# EAGLE design LED_card_GC_REV2 (EAGLE 9.5.2)
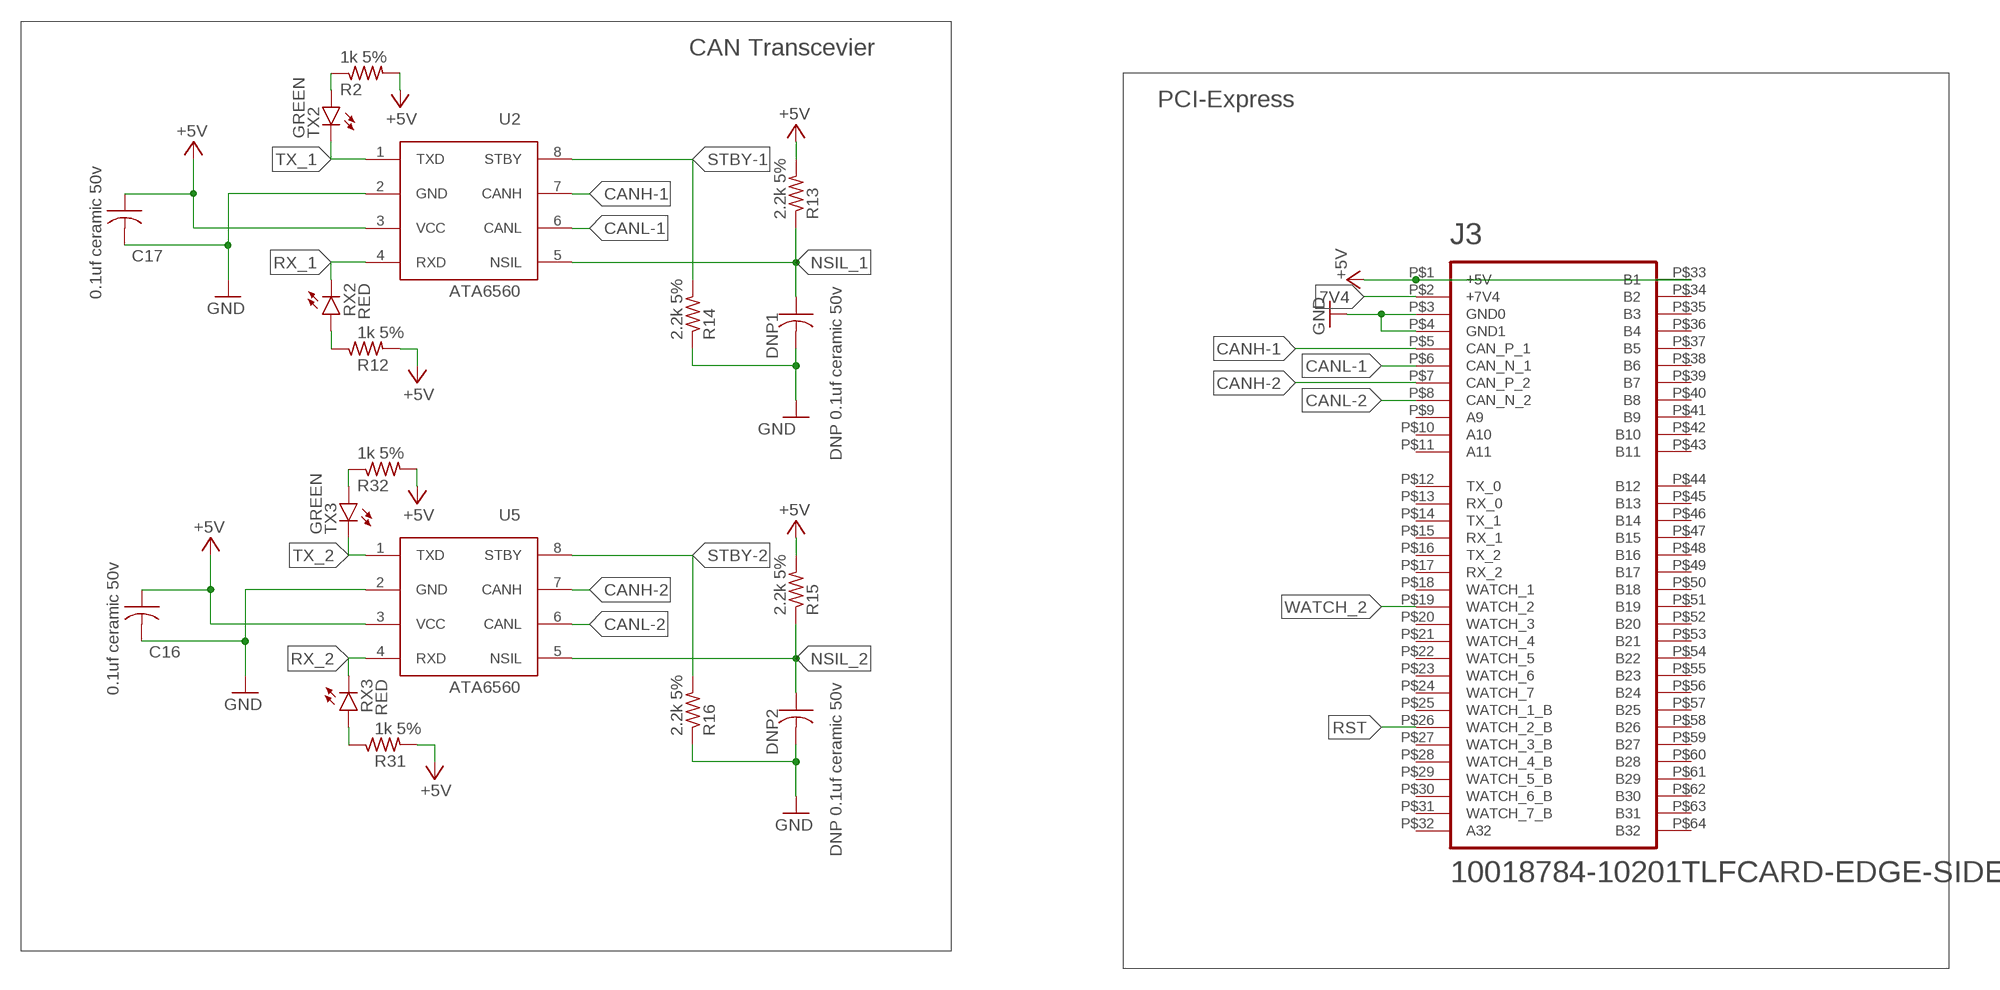
[diagram p0: schematic, sheet 1, part 1 of 3]
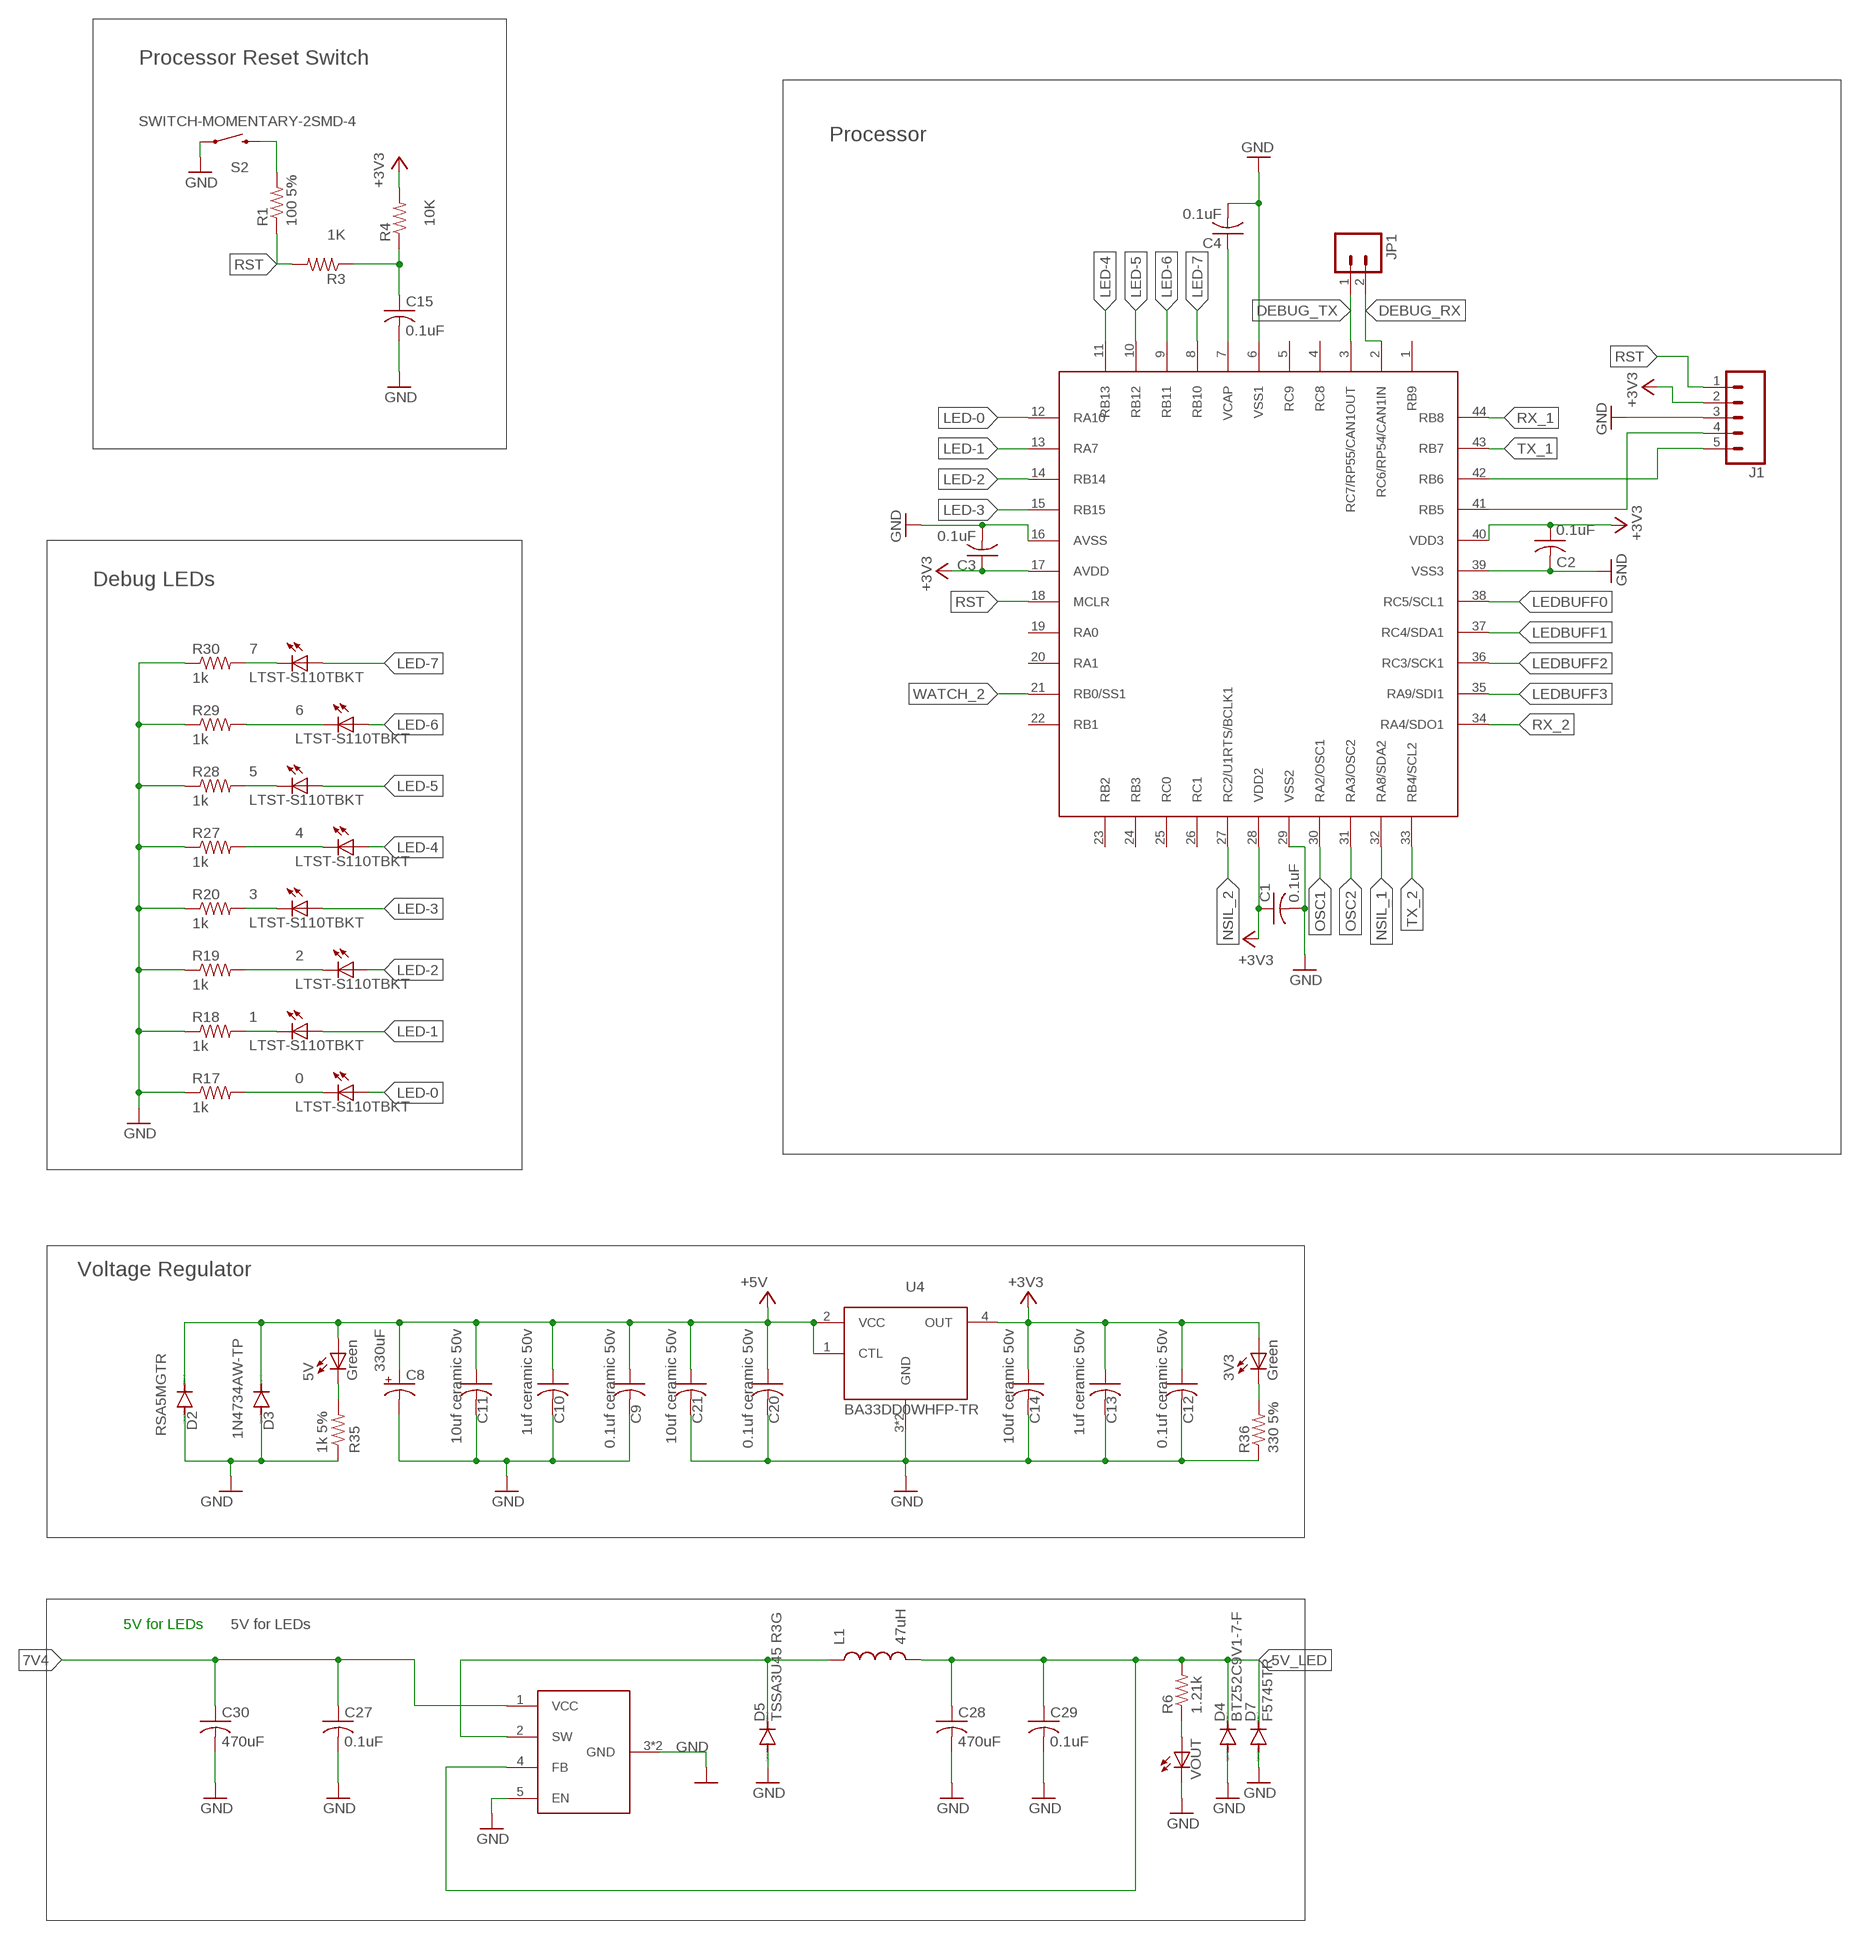
[diagram p1: schematic, sheet 1, part 2 of 3]
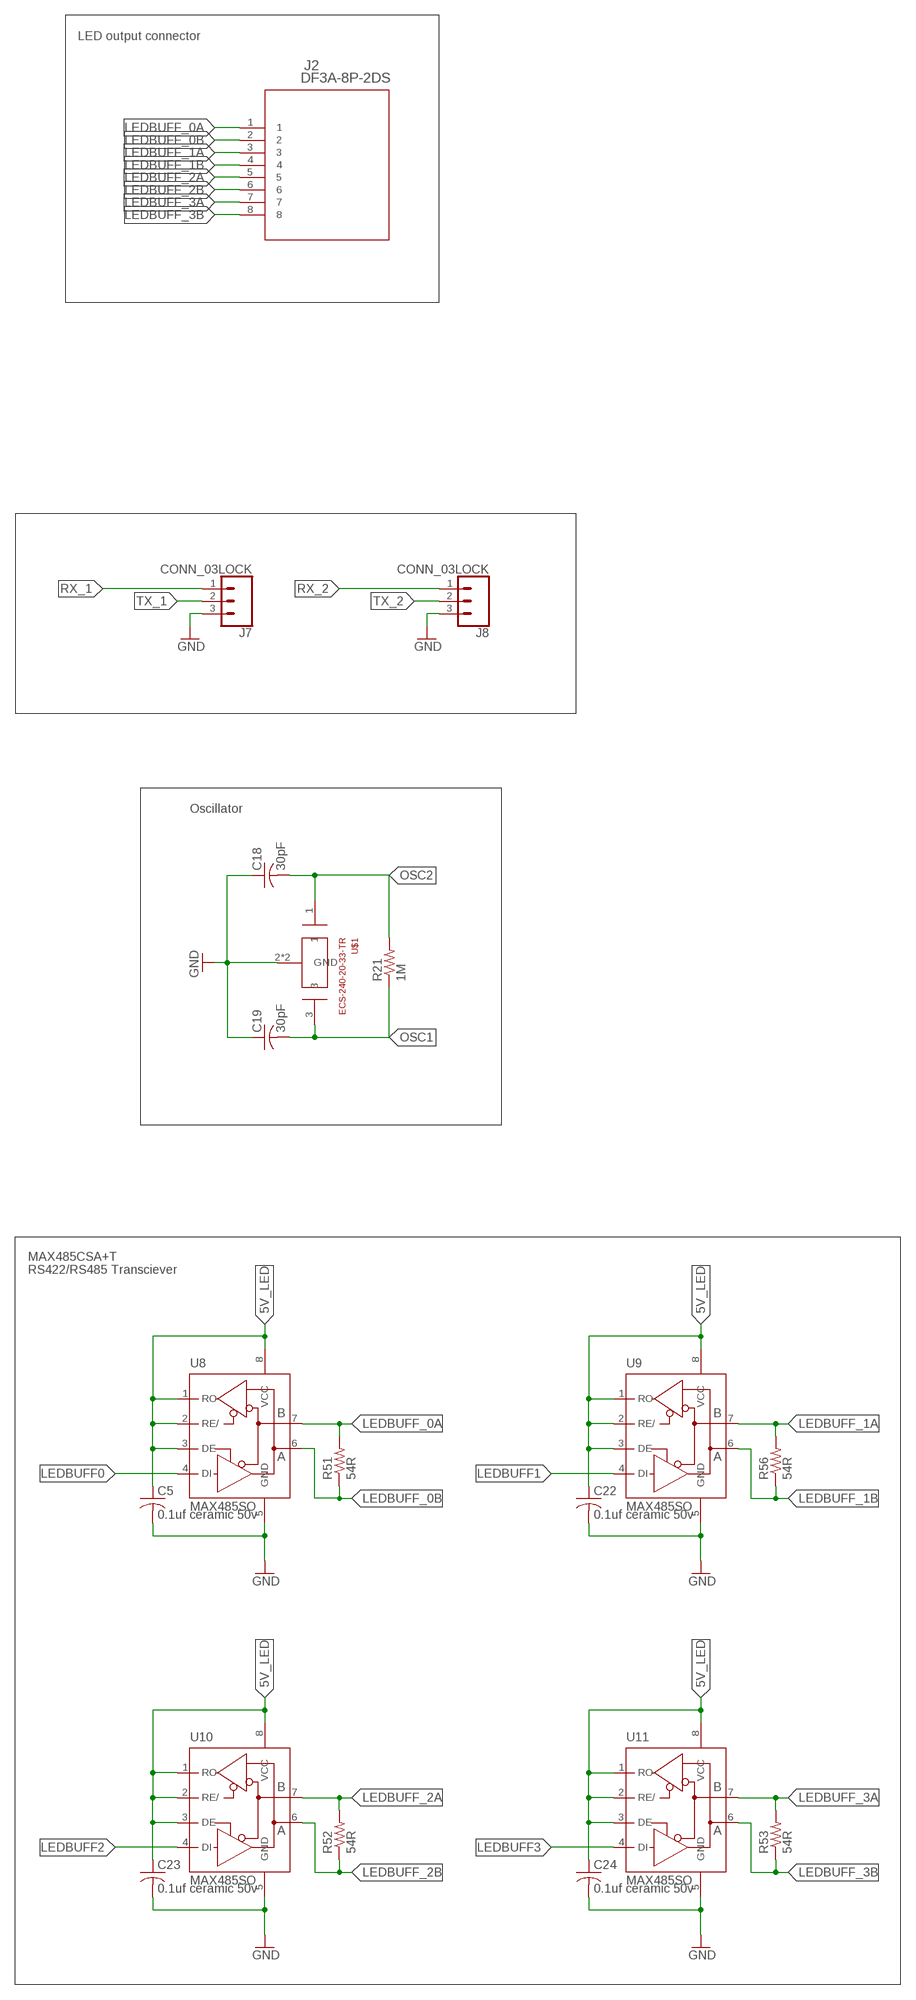
[diagram p2: schematic, sheet 1, part 3 of 3]

## Parts
0  LTST-S110TBKT  [LED-90]
1  LTST-S110TBKT  [LED-90]
2  LTST-S110TBKT  [LED-90]
3  LTST-S110TBKT  [LED-90]
3V3  Green  LTST-S110TBKT  [LED-90]
4  LTST-S110TBKT  [LED-90]
5  LTST-S110TBKT  [LED-90]
5V  Green  LTST-S110TBKT  [LED-90]
6  LTST-S110TBKT  [LED-90]
7  LTST-S110TBKT  [LED-90]
C1  0.1uF  C-US_0805C0805  [C0805]
C2  0.1uF  C-US_0805C0805  [C0805]
C3  0.1uF  C-US_0805C0805  [C0805]
C4  0.1uF  C-US_0805C0805  [C0805]
C5  0.1uf ceramic 50v  C-USC0805  [C0805]
C8  330uF  CPOL-US140CLH-1014  [140CLH-1014]
C9  0.1uf ceramic 50v  C-US_0805C0805  [C0805]
C10  1uf ceramic 50v  C-US_0805C0805  [C0805]
C11  10uf ceramic 50v  C-US_0805C0805  [C0805]
C12  0.1uf ceramic 50v  C-US_0805C0805  [C0805]
C13  1uf ceramic 50v  C-US_0805C0805  [C0805]
C14  10uf ceramic 50v  C-US_0805C0805  [C0805]
C15  0.1uF  C-US_0805C0805  [C0805]
C16  0.1uf ceramic 50v  C-US_0805C0805  [C0805]
C17  0.1uf ceramic 50v  C-US_0805C0805  [C0805]
C18  30pF  C-US_0805C0805  [C0805]
C19  30pF  C-US_0805C0805  [C0805]
C20  0.1uf ceramic 50v  C-US_0805C0805  [C0805]
C21  10uf ceramic 50v  C-US_0805C0805  [C0805]
C22  0.1uf ceramic 50v  C-USC0805  [C0805]
C23  0.1uf ceramic 50v  C-USC0805  [C0805]
C24  0.1uf ceramic 50v  C-USC0805  [C0805]
C27  0.1uF  C-USC1825  [C1825]
C28  470uF  C-USC1825  [C1825]
C29  0.1uF  C-USC1825  [C1825]
C30  470uF  C-USC1825  [C1825]
D2  RSA5MGTR  DIODE-SOD123  [SOD123]
D3  1N4734AW-TP  DIODE-SOD123  [SOD123]
D4  BTZ52C9V1-7-F  DIODE-SOD123  [SOD123]
D5  TSSA3U45 R3G  DIODE-DO214AC  [DO214AC]
D7  F5745TR  DIODE-SOD123  [SOD123]
DNP1  DNP 0.1uf ceramic 50v  C-US_0805C0805  [C0805]
DNP2  DNP 0.1uf ceramic 50v  C-US_0805C0805  [C0805]
J1  CONN_05LOCK  [1X05_LOCK]
J2  DF3A-8P-2DS  [CON8_1X8_R_DF3]
J3  10018784-10201TLFCARD-EDGE-SIDE  [CARDEDGE_SIDE]
J7  CONN_03LOCK  [1X03_LOCK]
J8  CONN_03LOCK  [1X03_LOCK]
JP1  CONN_02PTH  [1X02]
L1  47uH  INDUCTOR1  [0805]
R1  100 5%  R-US_0805R0805  [R0805]
R2  1k 5%  R-US_0805R0805  [R0805]
R3  1K  R-US_0805R0805  [R0805]
R4  10K  R-US_0805R0805  [R0805]
R6  1.21k  R-US_R0805  [R0805]
R12  1k 5%  R-US_0805R0805  [R0805]
R13  2.2k 5%  R-US_0805R0805  [R0805]
R14  2.2k 5%  R-US_0805R0805  [R0805]
R15  2.2k 5%  R-US_0805R0805  [R0805]
R16  2.2k 5%  R-US_0805R0805  [R0805]
R17  1k  R-US_0805R0805  [R0805]
R18  1k  R-US_0805R0805  [R0805]
R19  1k  R-US_0805R0805  [R0805]
R20  1k  R-US_0805R0805  [R0805]
R21  1M  R-US_0805R0805  [R0805]
R27  1k  R-US_0805R0805  [R0805]
R28  1k  R-US_0805R0805  [R0805]
R29  1k  R-US_0805R0805  [R0805]
R30  1k  R-US_0805R0805  [R0805]
R31  1k 5%  R-US_0805R0805  [R0805]
R32  1k 5%  R-US_0805R0805  [R0805]
R35  1k 5%  R-US_0805R0805  [R0805]
R36  330 5%  R-US_0805R0805  [R0805]
R51  54R  RESISTOR0805-RES  [0805]
R52  54R  RESISTOR0805-RES  [0805]
R53  54R  RESISTOR0805-RES  [0805]
R56  54R  RESISTOR0805-RES  [0805]
RX2  RED  LEDS_0805CHIP-LED0805  [CHIP-LED0805]
RX3  RED  LEDS_0805CHIP-LED0805  [CHIP-LED0805]
S2  SWITCH-MOMENTARY-2SMD-4  [TACTILE_SWITCH_TALL]
TX2  GREEN  LEDS_0805CHIP-LED0805  [CHIP-LED0805]
TX3  GREEN  LEDS_0805CHIP-LED0805  [CHIP-LED0805]
U2  ATA6560  [SO08]
U3  DSPIC33EP512GM604  [TQFP-44]
U4  BA33DD0WHFP-TR  [HRP5]
U5  ATA6560  [SO08]
U8  MAX485SO  [SO08]
U9  MAX485SO  [SO08]
U10  MAX485SO  [SO08]
U11  MAX485SO  [SO08]
U$1  ECS-240-20-33-TR  [ECX-32]
U$3  TS2596CM550  [HRP5]
VOUT1  VOUT  LEDCHIP-LED0805  [CHIP-LED0805]

## Nets
5V_LED: C5.1 C22.1 C23.1 C24.1 C28.1 C29.1 D4.C D7.C L1.2 R6.2 U8.1(RO) U8.2(RE/) U8.3(DE) U8.8(VCC) U9.1(RO) U9.2(RE/) U9.3(DE) U9.8(VCC) U10.1(RO) U10.2(RE/) U10.3(DE) U10.8(VCC) U11.1(RO) U11.2(RE/) U11.3(DE) U11.8(VCC) U$3.4(FB)
7V4: C27.1 C30.1 J3.P$2(+7V4) U$3.1(VCC)
+3V3: 3V3.+(A+) C1.1 C2.1 C3.1 C12.1 C13.1 C14.1 J1.2 R4.2 U3.17(AVDD) U3.28(VDD2) U3.40(VDD3) U4.4(OUT)
+5V: 5V.+(A+) C8.+ C9.1 C10.1 C11.1 C16.1 C17.1 C20.1 C21.1 D2.C D3.C J3.P$1(+5V) J3.P$33(B1) R2.2 R12.2 R13.2 R15.2 R31.2 R32.2 U2.3(VCC) U4.1(CTL) U4.2(VCC) U5.3(VCC)
CANH-1: J3.P$5(CAN_P_1) U2.7(CANH)
CANH-2: J3.P$7(CAN_P_2) U5.7(CANH)
CANL-1: J3.P$6(CAN_N_1) U2.6(CANL)
CANL-2: J3.P$8(CAN_N_2) U5.6(CANL)
DEBUG_RX: JP1.2 U3.2(RC6/RP54/CAN1IN)
DEBUG_TX: JP1.1 U3.3(RC7/RP55/CAN1OUT)
GND: C1.2 C2.2 C3.2 C4.2 C5.2 C8.- C9.2 C10.2 C11.2 C12.2 C13.2 C14.2 C15.2 C16.2 C17.2 C18.1 C19.1 C20.2 C21.2 C22.2 C23.2 C24.2 C27.2 C28.2 C29.2 C30.2 D2.A D3.A D4.A D5.A D7.A DNP1.2 DNP2.2 J1.3 J3.P$3(GND0) J3.P$4(GND1) J7.3 J8.3 R14.1 R16.1 R17.1 R18.1 R19.1 R20.1 R27.1 R28.1 R29.1 R30.1 R35.1 R36.1 S2.A2 U2.2(GND) U3.6(VSS1) U3.16(AVSS) U3.29(VSS2) U3.39(VSS3) U4.3(GND) U4.G(GND) U5.2(GND) U8.5(GND) U9.5(GND) U10.5(GND) U11.5(GND) U$1.2(GND) U$1.4(GND) U$3.3(GND) U$3.5(EN) U$3.G(GND) VOUT1.C
LED-0: 0.+(A+) U3.12(RA10)
LED-1: 1.+(A+) U3.13(RA7)
LED-2: 2.+(A+) U3.14(RB14)
LED-3: 3.+(A+) U3.15(RB15)
LED-4: 4.+(A+) U3.11(RB13)
LED-5: 5.+(A+) U3.10(RB12)
LED-6: 6.+(A+) U3.9(RB11)
LED-7: 7.+(A+) U3.8(RB10)
LEDBUFF0: U3.38(RC5/SCL1) U8.4(DI)
LEDBUFF1: U3.37(RC4/SDA1) U9.4(DI)
LEDBUFF2: U3.36(RC3/SCK1) U10.4(DI)
LEDBUFF3: U3.35(RA9/SDI1) U11.4(DI)
LEDBUFF_0A: J2.1 R51.2 U8.7(B)
LEDBUFF_0B: J2.2 R51.1 U8.6(A)
LEDBUFF_1A: J2.3 R56.2 U9.7(B)
LEDBUFF_1B: J2.4 R56.1 U9.6(A)
LEDBUFF_2A: J2.5 R52.2 U10.7(B)
LEDBUFF_2B: J2.6 R52.1 U10.6(A)
LEDBUFF_3A: J2.7 R53.2 U11.7(B)
LEDBUFF_3B: J2.8 R53.1 U11.6(A)
N$1 [New Class]: C15.1 R3.1 R4.1
N$2 [New Class]: R1.2 S2.B2
N$3: 5V.-(C-) R35.2
N$4: 3V3.-(C-) R36.2
N$5 [New Class]: J1.5 U3.42(RB6)
N$6: 6.-(C-) R29.2
N$7: D5.C L1.1 U$3.2(SW)
N$8: R6.1 VOUT1.A
N$35: 7.-(C-) R30.2
N$36 [New Class]: J1.4 U3.41(RB5)
N$37 [New Class]: C4.1 U3.7(VCAP)
N$39: 5.-(C-) R28.2
N$40: 4.-(C-) R27.2
N$41: 3.-(C-) R20.2
N$42: 2.-(C-) R19.2
N$43: 1.-(C-) R18.2
N$46: 0.-(C-) R17.2
N$58: R12.1 RX2.A
N$59: R2.1 TX2.A
N$60: R31.1 RX3.A
N$61: R32.1 TX3.A
NSIL_1: DNP1.1 R13.1 U2.5(NSIL) U3.32(RA8/SDA2)
NSIL_2: DNP2.1 R15.1 U3.27(RC2/U1RTS/BCLK1) U5.5(NSIL)
OSC1: C19.2 R21.1 U3.30(RA2/OSC1) U$1.3
OSC2: C18.2 R21.2 U3.31(RA3/OSC2) U$1.1
RST [New Class]: J1.1 J3.P$26(WATCH_2_B) R1.1 R3.2 U3.18(MCLR)
RX_1: J7.1 RX2.C U2.4(RXD) U3.44(RB8)
RX_2: J8.1 RX3.C U3.34(RA4/SDO1) U5.4(RXD)
STBY-1: R14.2 U2.8(STBY)
STBY-2: R16.2 U5.8(STBY)
TX_1: J7.2 TX2.C U2.1(TXD) U3.43(RB7)
TX_2: J8.2 TX3.C U3.33(RB4/SCL2) U5.1(TXD)
WATCH_2: J3.P$19(WATCH_2) U3.21(RB0/SS1)
Unconnected: J3.P$9(A9) J3.P$10(A10) J3.P$11(A11) J3.P$12(TX_0) J3.P$13(RX_0) J3.P$14(TX_1) J3.P$15(RX_1) J3.P$16(TX_2) J3.P$17(RX_2) J3.P$18(WATCH_1) J3.P$20(WATCH_3) J3.P$21(WATCH_4) J3.P$22(WATCH_5) J3.P$23(WATCH_6) J3.P$24(WATCH_7) J3.P$25(WATCH_1_B) J3.P$27(WATCH_3_B) J3.P$28(WATCH_4_B) J3.P$29(WATCH_5_B) J3.P$30(WATCH_6_B) J3.P$31(WATCH_7_B) J3.P$32(A32) J3.P$34(B2) J3.P$35(B3) J3.P$36(B4) J3.P$37(B5) J3.P$38(B6) J3.P$39(B7) J3.P$40(B8) J3.P$41(B9) J3.P$42(B10) J3.P$43(B11) J3.P$44(B12) J3.P$45(B13) J3.P$46(B14) J3.P$47(B15) J3.P$48(B16) J3.P$49(B17) J3.P$50(B18) J3.P$51(B19) J3.P$52(B20) J3.P$53(B21) J3.P$54(B22) J3.P$55(B23) J3.P$56(B24) J3.P$57(B25) J3.P$58(B26) J3.P$59(B27) J3.P$60(B28) J3.P$61(B29) J3.P$62(B30) J3.P$63(B31) J3.P$64(B32) U3.1(RB9) U3.4(RC8) U3.5(RC9) U3.19(RA0) U3.20(RA1) U3.22(RB1) U3.23(RB2) U3.24(RB3) U3.25(RC0) U3.26(RC1)

## Notes on the sheet
- CAN Transcevier
- PCI-Express
- LED output connector
- Processor Reset Switch
- Processor
- Oscillator
- Debug LEDs
- MAX485CSA+T
  RS422/RS485 Transciever
- Voltage Regulator
- 5V for LEDs | 5V for LEDs

## Library data of the parts
0 1-3 3V3 4 5 5V 6 7 = UA_NASA_RMC-Diodes:LTST-S110TBKT
C1-C4 C9-C21 DNP1 DNP2 = UA_NASA_RMC-Capacitors:C-US_0805: CAPACITOR, American symbol; SPICEPREFIX: C
C5 C22-C24 = rcl:C-US: CAPACITOR, American symbol
C8 = UA_NASA_RMC-Capacitors:CPOL-US: POLARIZED CAPACITOR, American symbol
C27-C30 = adafruit:C-US: CAPACITOR, American symbol
D2 D4 D5 D7 = UA_NASA_RMC-Diodes:DIODE-: DIODE
D3 = UA_NASA_RMC-Diodes:DIODE-: DIODE; SPICEPREFIX: D
J1 = UA_NASA_RMC-Connectors:CONN_05: Multi connection point. Often used as Generic Header-pin footprint for 0.1 inch spaced/style header connections On any of the 0.1 inch spaced packages, you can populate with these: Break Away Headers - Straight <https://www.sparkfun.com/products/116> (PRT-00116) Break Away Male Headers - Right Angle <https://www.sparkfun.com/products/553> (PRT-00553) Female Headers <https://www.sparkfun.com/products/115> (PRT-00115) Break Away Headers - Machine Pin <https://www.sparkfun.com/products/117> (PRT-00117) Break Away Female Headers - Swiss Machine Pin <https://www.sparkfun.com/products/743> (PRT-00743) For SCREWTERMINALS and SPRING TERMINALS visit here: Screw Terimnals on SparkFun.com <https://www.sparkfun.com/search/results?term=Screw+Terminals> (5mm/3.5mm/2.54mm spacing) This device is also useful as a general connection point to wire up your design to another part of your project. Our various solder wires solder well into these plated through hole pads. Hook-Up Wire - Assortment (Stranded, 22 AWG) <https://www.sparkfun.com/products/11375> (PRT-11375) Hook-Up Wire - Assortment (Solid Core, 22 AWG) <https://www.sparkfun.com/products/11367> (PRT-11367) View the entire wire category on our website here <https://www.sparkfun.com/categories/141> Special notes: Molex polarized connector foot print use with SKU : PRT-08231 with associated crimp pins and housings. 1MM SMD Version SKU: PRT-10208
J2 = UA_NASA_RMC-Connectors:DF3A-8P-2DS; BUILT_BY: EMA_UL_Team; MANUFACTURER_PART_NUMBER: DF3A-8P-2DS; VENDOR: Hirose
J3 = Through_hole_card_edge_v1:10018784-10201TLF: CONN PCI EXP FEMALE 64POS 0.039
J7 J8 = UA_NASA_RMC-Connectors:CONN_03: Multi connection point. Often used as Generic Header-pin footprint for 0.1 inch spaced/style header connections On any of the 0.1 inch spaced packages, you can populate with these: Break Away Headers - Straight <https://www.sparkfun.com/products/116> (PRT-00116) Break Away Male Headers - Right Angle <https://www.sparkfun.com/products/553> (PRT-00553) Female Headers <https://www.sparkfun.com/products/115> (PRT-00115) Break Away Headers - Machine Pin <https://www.sparkfun.com/products/117> (PRT-00117) Break Away Female Headers - Swiss Machine Pin <https://www.sparkfun.com/products/743> (PRT-00743) Stackable Header - 3 Pin (Female, 0.1") <https://www.sparkfun.com/products/13875> (PRT-13875) For SCREWTERMINALS and SPRING TERMINALS visit here: Screw Terimnals on SparkFun.com <https://www.sparkfun.com/search/results?term=Screw+Terminals> (5mm/3.5mm/2.54mm spacing) This device is also useful as a general connection point to wire up your design to another part of your project. Our various solder wires solder well into these plated through hole pads. Hook-Up Wire - Assortment (Stranded, 22 AWG) <https://www.sparkfun.com/products/11375> (PRT-11375) Hook-Up Wire - Assortment (Solid Core, 22 AWG) <https://www.sparkfun.com/products/11367> (PRT-11367) View the entire wire category on our website here <https://www.sparkfun.com/categories/141> Special notes: Molex polarized connector foot print use with SKU : PRT-08232 with associated crimp pins and housings.
JP1 = UA_NASA_RMC-Connectors:CONN_02: Standard 2-pin 0.1" header. Use with - straight break away headers ( PRT-00116) - right angle break away headers (PRT-00553) - swiss pins (PRT-00743) - machine pins (PRT-00117) - female headers (PRT-00115) Molex polarized connector foot print use with: PRT-08233 with associated crimp pins and housings. 2.54_SCREWTERM for use with PRT-10571. 3.5mm Screw Terminal footprints for PRT-08084 5mm Screw Terminal footprints for use with PRT-08432
L1 = UA_NASA_RMC-Inductors:INDUCTOR: Inductor 27uf Octopart <https://octopart.com/search?q=ISL83077EIBZA> https://octopart.com/search?q=AIML-0805-270K-T -NASA ROBOTICS
R1-R4 R12-R21 R27-R32 R35 R36 = UA_NASA_RMC-Resistors:R-US_0805: RESISTOR, American symbol; SPICEPREFIX: R
R6 = adafruit:R-US_: RESISTOR, American symbol
R51-R53 R56 = SparkFun-Resistors:RESISTOR: Resistor Basic schematic elements and footprints for 0603, 1206, and PTH resistors.
RX2 RX3 TX2 TX3 = UA_NASA_RMC-Diodes:LEDS_0805: LED 0805 OSRAM: - CHIPLED LG R971, LG N971, LY N971, LG Q971, LY Q971, LO R971, LY R971 LH N974, LH R974 LS Q976, LO Q976, LY Q976 LO Q996 - Hyper CHIPLED LW Q18S LB Q993, LB Q99A, LB R99A - SideLED LS A670, LO A670, LY A670, LG A670, LP A670 LB A673, LV A673, LT A673, LW A673 LH A674 LY A675 LS A676, LA A676, LO A676, LY A676, LW A676 LS A679, LY A679, LG A679 - Hyper Micro SIDELED® LS Y876, LA Y876, LO Y876, LY Y876 LT Y87S - SmartLED LW L88C, LW L88S LB L89C, LB L89S, LG L890 LS L89K, LO L89K, LY L89K LS L896, LA L896, LO L896, LY L896 - TOPLED LS T670, LO T670, LY T670, LG T670, LP T670 LSG T670, LSP T670, LSY T670, LOP T670, LYG T670 LG T671, LOG T671, LSG T671 LB T673, LV T673, LT T673, LW T673 LH T674 LS T676, LA T676, LO T676, LY T676, LB T676, LH T676, LSB T676, LW T676 LB T67C, LV T67C, LT T67C, LS T67K, LO T67K, LY T67K, LW E67C LS E67B, LA E67B, LO E67B, LY E67B, LB E67C, LV E67C, LT E67C LW T67C LS T679, LY T679, LG T679 LS T770, LO T770, LY T770, LG T770, LP T770 LB T773, LV T773, LT T773, LW T773 LH T774 LS E675, LA E675, LY E675, LS T675 LS T776, LA T776, LO T776, LY T776, LB T776 LHGB T686 LT T68C, LB T68C - Hyper Mini TOPLED® LB M676 - Mini TOPLED Santana® LG M470 LS M47K, LO M47K, LY M47K Source: http://www.osram.convergy.de LUXEON: - LUMILED® LXK2-PW12-R00, LXK2-PW12-S00, LXK2-PW14-U00, LXK2-PW14-V00 LXK2-PM12-R00, LXK2-PM12-S00, LXK2-PM14-U00 LXK2-PE12-Q00, LXK2-PE12-R00, LXK2-PE12-S00, LXK2-PE14-T00, LXK2-PE14-U00 LXK2-PB12-K00, LXK2-PB12-L00, LXK2-PB12-M00, LXK2-PB14-N00, LXK2-PB14-P00, LXK2-PB14-Q00 LXK2-PR12-L00, LXK2-PR12-M00, LXK2-PR14-Q00, LXK2-PR14-R00 LXK2-PD12-Q00, LXK2-PD12-R00, LXK2-PD12-S00 LXK2-PH12-R00, LXK2-PH12-S00 LXK2-PL12-P00, LXK2-PL12-Q00, LXK2-PL12-R00 Source: www.luxeon.com KINGBRIGHT: KA-3528ASYC Source: www.kingbright.com
S2 = UA_NASA_RMC-Switches:SWITCH-MOMENTARY-2: Various NO switches- pushbuttons, reed, etc Series: PTS645; PROD_ID: SWCH-11966
U2 U5 = UA_NASA_RMC-Microcontrollers:ATA6560
U3 = UA_NASA_RMC-Microcontrollers:DSPIC33EP512GM604
U4 = UA_NASA_RMC-Microcontrollers:BA33DD0WHFP-TR
U8-U11 = NASA_LIB (1):MAX485
U$1 = UA_NASA_RMC-Oscillators:ECS-240-20-33-TR
U$3 = UA_NASA_RMC-Microcontrollers:TS2596CM550
VOUT1 = adafruit:LED: LED OSRAM: - CHIPLED LG R971, LG N971, LY N971, LG Q971, LY Q971, LO R971, LY R971 LH N974, LH R974 LS Q976, LO Q976, LY Q976 LO Q996 - Hyper CHIPLED LW Q18S LB Q993, LB Q99A, LB R99A - SideLED LS A670, LO A670, LY A670, LG A670, LP A670 LB A673, LV A673, LT A673, LW A673 LH A674 LY A675 LS A676, LA A676, LO A676, LY A676, LW A676 LS A679, LY A679, LG A679 - Hyper Micro SIDELED® LS Y876, LA Y876, LO Y876, LY Y876 LT Y87S - SmartLED LW L88C, LW L88S LB L89C, LB L89S, LG L890 LS L89K, LO L89K, LY L89K LS L896, LA L896, LO L896, LY L896 - TOPLED LS T670, LO T670, LY T670, LG T670, LP T670 LSG T670, LSP T670, LSY T670, LOP T670, LYG T670 LG T671, LOG T671, LSG T671 LB T673, LV T673, LT T673, LW T673 LH T674 LS T676, LA T676, LO T676, LY T676, LB T676, LH T676, LSB T676, LW T676 LB T67C, LV T67C, LT T67C, LS T67K, LO T67K, LY T67K, LW E67C LS E67B, LA E67B, LO E67B, LY E67B, LB E67C, LV E67C, LT E67C LW T67C LS T679, LY T679, LG T679 LS T770, LO T770, LY T770, LG T770, LP T770 LB T773, LV T773, LT T773, LW T773 LH T774 LS E675, LA E675, LY E675, LS T675 LS T776, LA T776, LO T776, LY T776, LB T776 LHGB T686 LT T68C, LB T68C - Hyper Mini TOPLED® LB M676 - Mini TOPLED Santana® LG M470 LS M47K, LO M47K, LY M47K Source: http://www.osram.convergy.de/

## Board
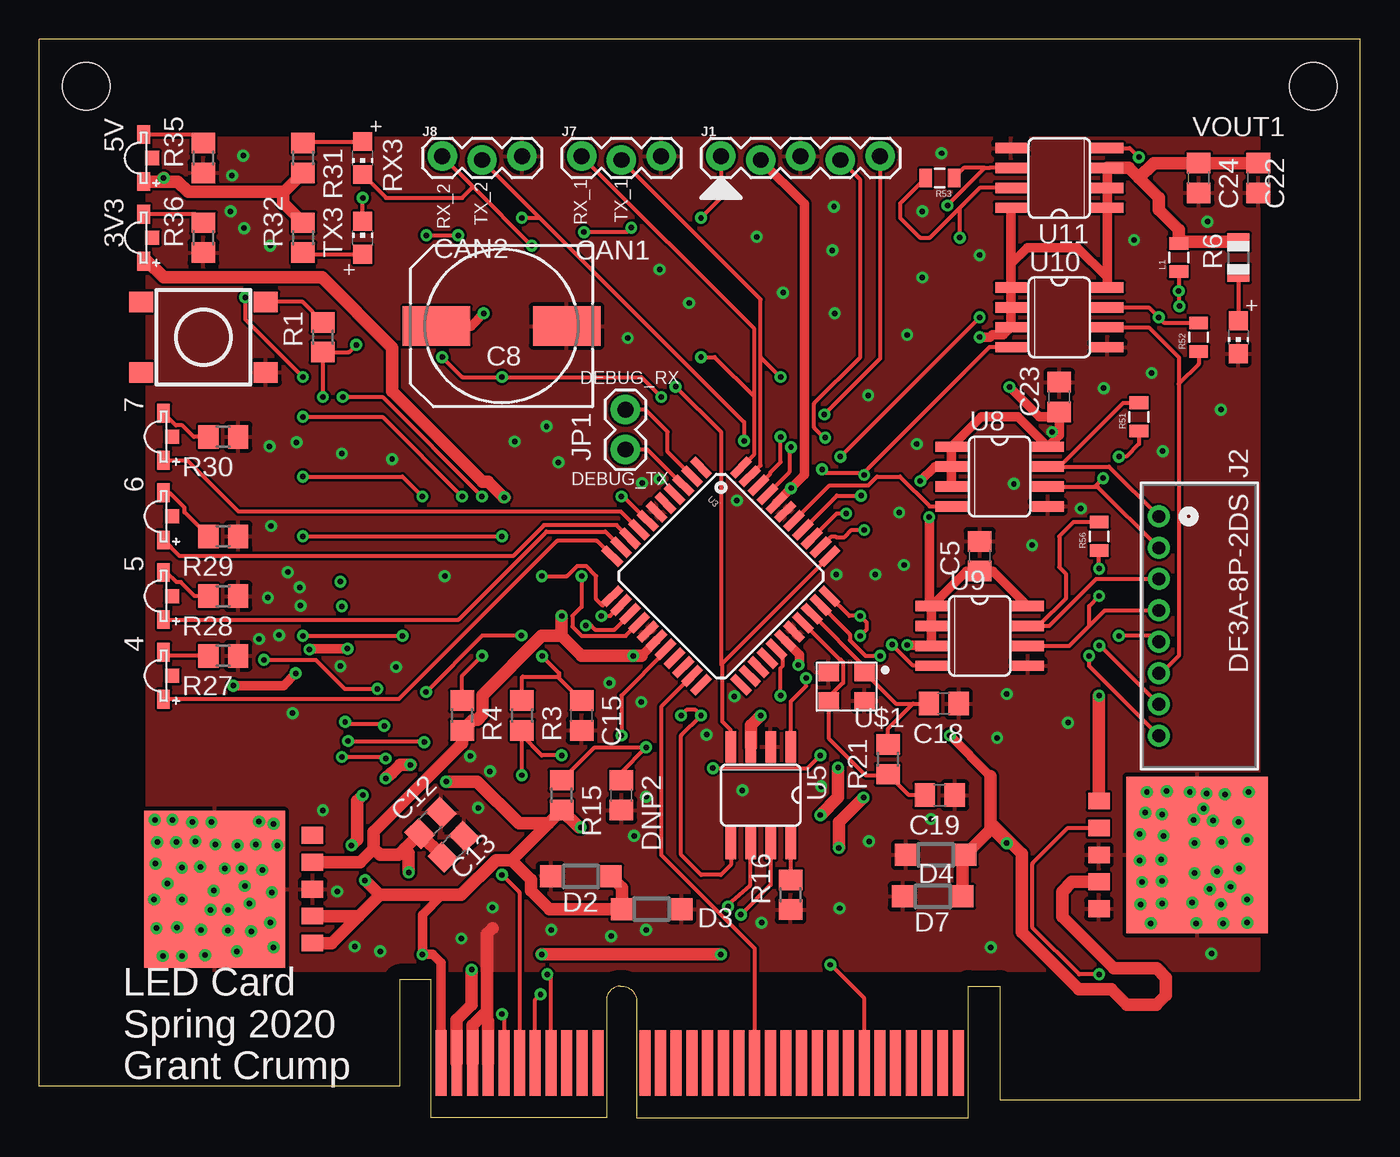
[diagram p3: board, top side]
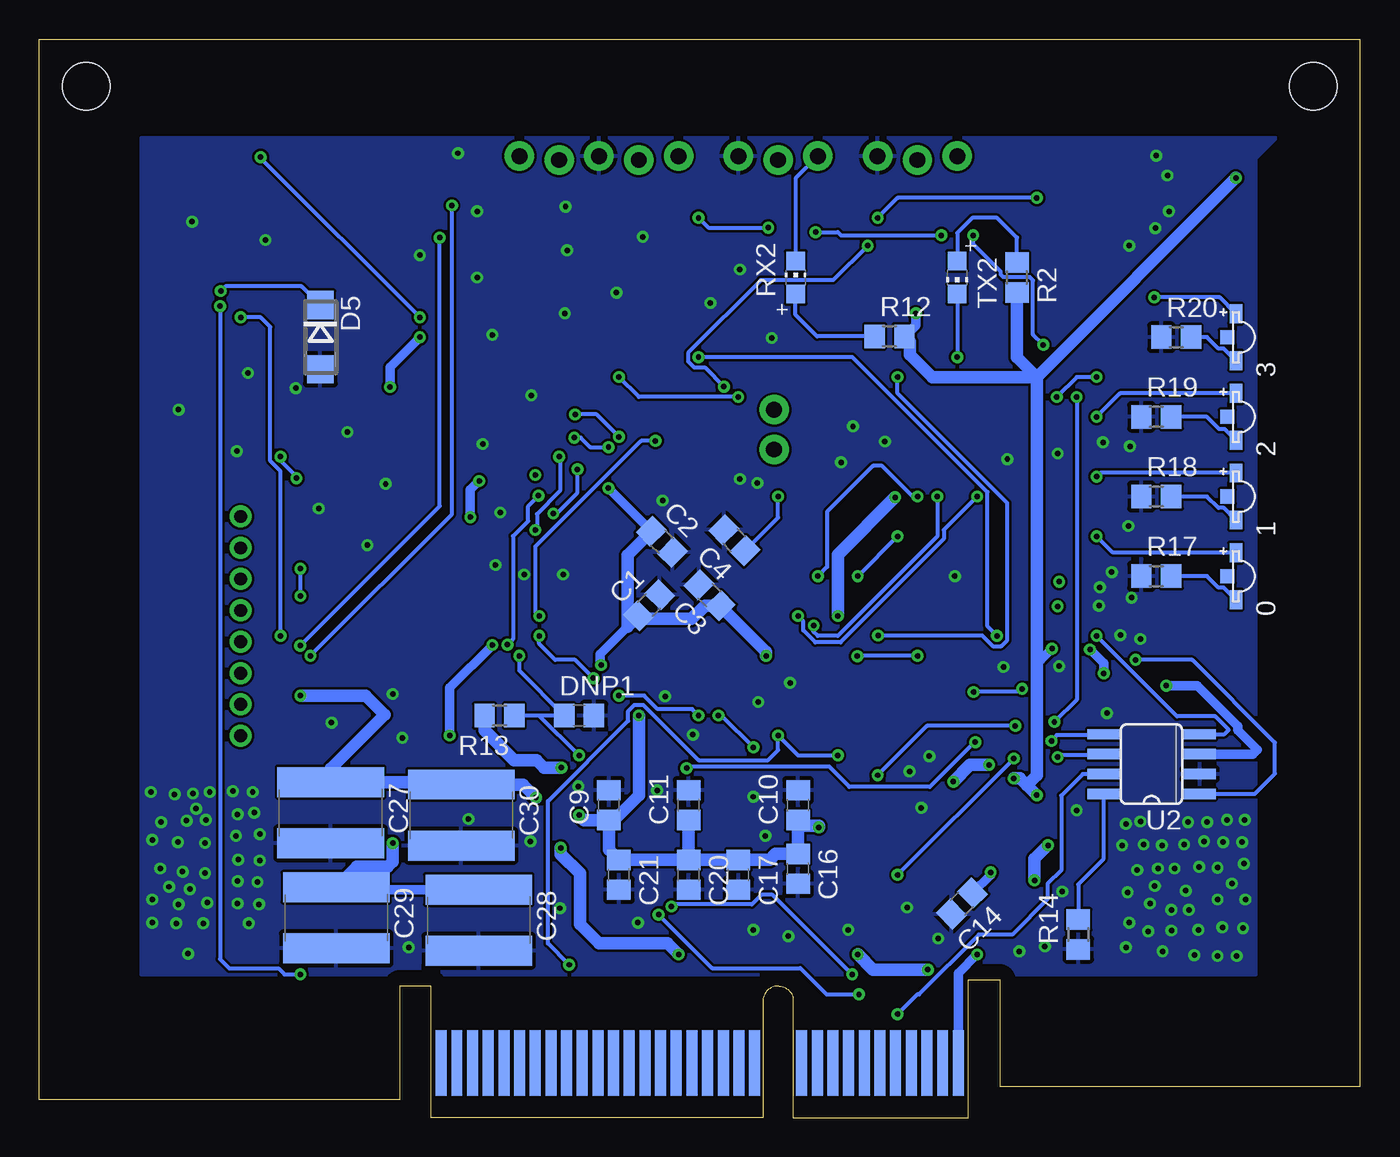
[diagram p4: board, bottom side, seen from below]

Size 84.3 x 68.8 mm. Coordinates in mm from the lower left corner, seen from the top.
Copper layers (1*16): Top 0.035mm / dielectric 1.5mm / Bottom 0.035mm
Design rules "default": minimum track width 6mil, minimum drill 0.35mm, track to track 6mil, track to pad 6mil, pad to pad 6mil, via to via 6mil, smd to smd 6mil, copper to edge 40mil, drill to drill 6mil, minimum pad ring 10mil, minimum via ring 8mil, stop-mask expansion 4mil, vias tented up to drill 0mil, thermal gap 10mil

### Footprints (pad centres in the part's own frame; a part is rotated, then mirrored left to right if it is on the bottom)
LED-90 = smd 0.8 x 1.2: + 0,1.5; - 0,-1.5 | smd 0.9 x 0.9: NC -0.55,0
C0805 = smd 1.3 x 1.5: 1 -0.95,0; 2 0.95,0
140CLH-1014 = smd 4.3 x 2.5: + 4.15,0; - -4.15,0
C1825 = smd 1.9 x 6.8: 1 -1.95,0; 2 1.95,0
SOD123 = smd 1.4 x 1.4: A 1.9,0; C -1.9,0
DO214AC = smd 1.8 x 1.7: A 2.05,0; C -2.05,0
1X05_LOCK = drill 1.016 pad 1.88: 1 0,0.127; 2 2.54,-0.127; 3 5.08,0.127; 4 7.62,-0.127; 5 10.16,0.127
CON8_1X8_R_DF3 = drill 0.813 pad 1.397: 1 0,0; 2 -2.007,0; 3 -3.988,0; 4 -5.994,0; 5 -8.001,0; 6 -10.008,0; 7 -11.989,0; 8 -13.995,0
CARDEDGE_SIDE = smd 0.7 x 4.2: P$1 -11.5,0.7; P$2 -10.5,0.7; P$3 -9.5,0.7; P$4 -8.5,0.7; P$5 -7.5,0.7; P$6 -6.5,0.7; P$7 -5.5,0.7; P$8 -4.5,0.7; P$9 -3.5,0.7; P$10 -2.5,0.7; P$11 -1.5,0.7; P$12 1.5,0.7; P$13 2.5,0.7; P$14 3.5,0.7; P$15 4.5,0.7; P$16 5.5,0.7; P$17 6.5,0.7; P$18 7.5,0.7; P$19 8.5,0.7; P$20 9.5,0.7; P$21 10.5,0.7; P$22 11.5,0.7; P$23 12.5,0.7; P$24 13.5,0.7; P$25 14.5,0.7; P$26 15.5,0.7; P$27 16.5,0.7; P$28 17.5,0.7; P$29 18.5,0.7; P$30 19.5,0.7; P$31 20.5,0.7; P$32 21.5,0.7 | smd 0.7 x 4.2 bottom: P$33 -11.5,0.7; P$34 -10.5,0.7; P$35 -9.5,0.7; P$36 -8.5,0.7; P$37 -7.5,0.7; P$38 -6.5,0.7; P$39 -5.5,0.7; P$40 -4.5,0.7; P$41 -3.5,0.7; P$42 -2.5,0.7; P$43 -1.5,0.7; P$44 1.5,0.7; P$45 2.5,0.7; P$46 3.5,0.7; P$47 4.5,0.7; P$48 5.5,0.7; P$49 6.5,0.7; P$50 7.5,0.7; P$51 8.5,0.7; P$52 9.5,0.7; P$53 10.5,0.7; P$54 11.5,0.7; P$55 12.5,0.7; P$56 13.5,0.7; P$57 14.5,0.7; P$58 15.5,0.7; P$59 16.5,0.7; P$60 17.5,0.7; P$61 18.5,0.7; P$62 19.5,0.7; P$63 20.5,0.7; P$64 21.5,0.7 | hole 3: -34.15,63; 44.15,63
1X03_LOCK = drill 1.016 pad 1.88: 1 0,0.127; 2 2.54,-0.127; 3 5.08,0.127
1X02 = drill 1.016 pad 1.88: 1 0,0; 2 2.54,0
0805 = smd 0.8 x 1.2: 1 -0.9,0; 2 0.9,0
R0805 = smd 1.3 x 1.5: 1 -0.95,0; 2 0.95,0
R0805' = smd 1.1 x 1.4: 1 -1,0; 2 1,0
CHIP-LED0805 = smd 1.2 x 1.2: A 0,-1.05; C 0,1.05
TACTILE_SWITCH_TALL = smd 1.55 x 1.3: A1 -3.975,-2.25; A2 3.975,-2.25; B1 -3.975,2.25; B2 3.975,2.25
SO08 = smd 0.66 x 2.032: 1 -1.905,-3.073; 2 -0.635,-3.073; 3 0.635,-3.073; 4 1.905,-3.073; 5 1.905,3.073; 6 0.635,3.073; 7 -0.635,3.073; 8 -1.905,3.073
TQFP-44 = smd 1.5 x 0.5: 1 -5.8,4; 2 -5.8,3.2; 3 -5.8,2.4; 4 -5.8,1.6; 5 -5.8,0.8; 6 -5.8,0; 7 -5.8,-0.8; 8 -5.8,-1.6; 9 -5.8,-2.4; 10 -5.8,-3.2; 11 -5.8,-4; 23 5.8,-4; 24 5.8,-3.2; 25 5.8,-2.4; 26 5.8,-1.6; 27 5.8,-0.8; 28 5.8,0; 29 5.8,0.8; 30 5.8,1.6; 31 5.8,2.4; 32 5.8,3.2; 33 5.8,4 | smd 0.5 x 1.5: 12 -4,-5.8; 13 -3.2,-5.8; 14 -2.4,-5.8; 15 -1.6,-5.8; 16 -0.8,-5.8; 17 0,-5.8; 18 0.8,-5.8; 19 1.6,-5.8; 20 2.4,-5.8; 21 3.2,-5.8; 22 4,-5.8; 34 4,5.8; 35 3.2,5.8; 36 2.4,5.8; 37 1.6,5.8; 38 0.8,5.8; 39 0,5.8; 40 -0.8,5.8; 41 -1.6,5.8; 42 -2.4,5.8; 43 -3.2,5.8; 44 -4,5.8
HRP5 = smd 1.07 x 1.37: 1 -3.44,0; 2 -1.72,0; 3 0,0; 4 1.72,0; 5 3.44,0 | smd 10 x 9: G 0,6.254
ECX-32 = smd 1.3 x 1.1: 1 -1.15,-0.9; 2 1.15,-0.9; 3 1.15,0.9; 4 -1.15,0.9

### Placement (x,y rotation side)
0  7.94,34.55 0 bottom
1  7.94,39.63 0 bottom
2  7.94,44.71 0 bottom
3  7.94,49.79 0 bottom
3V3  6.67,56.14 180 top
4  7.94,28.2 180 top
5  7.94,33.28 180 top
5V  6.67,61.22 180 top
6  7.94,38.36 180 top
7  7.94,43.44 180 top
C1  45.38,32.7 45 bottom
C2  44.57,36.73 315 bottom
C3  41.52,33.33 135 bottom
C4  39.94,36.84 135 bottom
C5  60.01,35.82 90 top
C8  29.5,50.5 180 top
C9  47.95,19.95 90 bottom
C10  35.88,19.95 90 bottom
C11  42.86,19.95 90 bottom
C12  24.96,18.8 45 top
C13  26.43,17.28 45 top
C14  25.42,13.67 225 bottom
C15  34.61,25.66 270 top
C16  35.88,15.88 270 bottom
C17  39.69,15.5 270 bottom
C18  57.72,26.42 180 top
C19  57.47,20.58 180 top
C20  42.86,15.5 270 bottom
C21  47.31,15.5 270 bottom
C22  77.79,59.95 270 top
C23  65.09,45.98 90 top
C24  73.98,59.95 270 top
C27  65.7,19.46 270 bottom
C28  56.25,12.6 270 bottom
C29  65.34,12.76 270 bottom
C30  57.37,19.31 270 bottom
D2  34.56,15.4 180 top
D3  39.08,13.32 0 top
D4  57.22,16.77 180 top
D5  66.36,49.79 270 bottom
D7  57.01,14.13 180 top
DNP1  49.85,25.66 0 bottom
DNP2  37.15,20.58 270 top
J1  43.5,61.22 0 top
J2  71.44,38.36 90 top
J3  37.15,2.8 0 top
J7  34.61,61.22 0 top
J8  25.72,61.22 0 top
JP1  37.4,42.63 90 top
L1  72.71,54.87 90 top
R1  18.1,49.79 90 top
R2  21.91,53.6 270 bottom
R3  30.8,25.66 270 top
R4  26.99,25.66 270 top
R6  1.21k  [R0805']  76.52,54.87 90 top
R12  30.04,49.84 0 bottom
R13  54.93,25.66 180 bottom
R14  18,11.69 90 bottom
R15  33.34,20.58 270 top
R16  47.95,14.23 90 top
R17  13.02,34.55 0 bottom
R18  13.02,39.63 0 bottom
R19  13.02,44.71 0 bottom
R20  11.75,49.79 0 bottom
R21  54.17,22.87 90 top
R27  11.75,29.47 180 top
R28  11.75,33.28 180 top
R29  11.75,37.09 180 top
R30  11.75,43.44 180 top
R31  16.83,61.22 270 top
R32  16.83,56.14 90 top
R35  10.48,61.22 90 top
R36  10.48,56.14 90 top
R51  70.17,44.71 90 top
R52  73.98,49.79 90 top
R53  57.47,59.95 180 top
R56  67.63,37.09 90 top
RX2  36.03,53.6 0 bottom
RX3  20.64,61.22 180 top
S2  10.48,49.79 0 top
TX2  25.72,53.6 180 bottom
TX3  20.64,56.14 0 top
U2  13.32,22.56 90 bottom
U3  43.5,34.55 315 top
U4  17.44,14.59 90 top
U5  46.04,20.58 180 top
U8  61.28,40.9 270 top
U9  60.01,30.74 270 top
U10  65.09,51.06 270 top
U11  65.09,59.95 90 top
U$1  51.52,27.51 180 top
U$3  67.63,16.77 270 top
VOUT1  76.52,49.79 180 top

### Tracks (layer width: path | path; a pad name or v marks a point on that pad's centre or on a via)
5V_LED  (via drill 0.35)
  Top 0.61: U8.2 U8.1 60.11,44.71 62.45,44.71 U8.8 65.09,43.54 65.09,44.71 | U8.2 U8.3 | 65.09,44.71 C23.1 | U10.8 68.16,53.6 | 68.16,53.6 U11.1 U11.2 U11.3 | U9.1 56.79,32.79 v56.79,38.31 | v56.22,40.62 57.14,41.53 U8.2 | U9.1 59.16,34.87 C5.1 60.86,34.87 U9.8 | v55.38,30.16 56.89,30.16 U9.3 U9.2 U9.1 | 60.71,21.79 v58.1,24.39 | v60.01,49.79 60.66,49.79 60.81,49.94 61.53,49.94 U10.3 U10.2 U10.1 62.02,54.46 | v61.91,46.61 63.82,44.71 65.09,44.71 | 68.16,53.6 66.26,55.5 63.06,55.5 62.02,54.46 | 62.02,54.46 U11.8
  Top 0.813: 70.17,59.95 71.44,58.68 71.44,57.92 72.71,56.65 L1.2 72.81,55.87 R6.2 | 70.17,59.95 69.53,60.58 U11.3 | C22.1 C24.1 71.12,60.9 70.17,59.95 | D7.C 58.91,16.57 D4.C 60.71,18.36 | 60.71,18.36 60.71,18.85 | 60.71,18.85 60.71,21.79 | v61.74,17.52 60.89,18.36 60.71,18.36 | 60.71,18.85 62.7,16.86 62.7,11.84 66.33,8.21 67.5,8.21 68.42,8.21 69.41,7.22 71.29,7.22 71.9,7.83 71.9,8.95 71.31,9.54 68.57,9.54 65.29,12.81 65.29,14.43 65.91,15.05 U$3.4
  Bottom 0.61: v56.79,38.31 56.79,40.06 v56.22,40.62 | v55.38,30.16 58.1,27.44 v58.1,24.39 | C29.1 65.19,14.55 C28.1 | v60.01,49.79 61.91,47.88 v61.91,46.61
  Bottom 0.813: C29.1 64.05,16 62.07,16 61.74,16.33 v61.74,17.52
7V4  (via drill 0.35)
  Top 0.813: v43.5,10.42 v32.07,10.42 | v27.6,9.46 27.6,7.22 26.65,6.27 J3.P$2 | v67.63,26.93 U$3.1 | v52.6,20.43 51.02,18.84 v51.02,17.22
  Bottom 0.813: v43.5,10.42 44.21,11.13 48.58,11.13 49.8,12.35 49.8,15.6 51.02,16.82 v51.02,17.22 | v32.07,10.42 31.1,9.46 v27.6,9.46 | v67.63,26.93 63.48,26.93 62.27,25.71 65.7,22.28 C27.1 57.52,21.41 C30.1 56.81,21.26 53.44,21.26 v52.6,20.43
+3V3  (via drill 0.35)
  Top 0.152: 3V3.+ 6.9,54.64
  Top 0.61: J1.2 48.83,58.3 48.83,41.02 v47.98,40.16 U3.40 | U3.28 48.51,29.54 48.51,28.94 v48.45,28.88 | U3.17 | U3.17 38.42,29.47
  Top 0.813: 33.34,30.74 34.61,29.47 v37.91,29.47 38.42,29.47 | 33.34,30.74 v33.34,32.01 | 6.9,54.64 7.94,53.6 18.05,53.6 22.52,49.13 22.52,46.34 28.29,40.57 28.65,40.57 29.64,39.58 v29.68,39.58 | 33.34,30.74 32.07,30.74 28.3,26.97 28.3,25.73 27.97,25.4 27.68,25.4 R4.2 26.99,23.9 21.35,18.26 21.35,17.16 | 23.31,17.15 22.93,16.77 21.75,16.77 21.35,17.16 | 23.31,17.15 C12.1 25.76,16.66 C13.1 | v23.59,15.65 23.59,16.87 23.31,17.15 | U4.4 20.49,16.31 21.35,17.16
  Bottom 0.61: C1.1 46.76,31.31 48.51,29.57 48.51,28.94 v48.45,28.88 | C14.1 23.59,15.5 v23.59,15.65 | C2.1 v47.98,40.16
  Bottom 0.813: v29.68,39.58 33.34,35.92 v33.34,32.01 | v37.91,29.47 37.91,29.72 C3.1 41.82,32.66 42.66,31.82 46.26,31.82 46.76,31.31 46.76,35.88 C2.1
+5V  (via drill 0.35)
  Top 0.61: 25.72,14.23 24.45,12.96 v24.45,10.42 25.11,10.42 25.65,9.88 J3.P$33 | v16.37,28.35 15.58,27.57 v12.38,27.57 | v17.25,29.87 17.3,29.93 v19.67,29.93 | v28.36,51.31 27.55,50.5 C8.+
  Top 0.813: v7.94,59.95 7.71,59.72 5V.+ 8.84,59.72 9.5,59.06 15.56,59.06 | v20.64,20.58 20.28,20.22 20.28,17.73 v19.93,17.38 | U4.1 18.67,11.15 20.39,12.87 | 20.39,12.87 21.76,14.23 | R31.2 15.62,59.06 15.56,59.06 | R32.2 15.56,58.36 15.56,59.06 | U5.3 45.41,25.03 v46.04,25.66 | 32.49,18.78 R15.2 34.45,18.52 v34.56,18.52 | 32.49,18.78 30.15,16.44 | 30.15,16.44 29.14,16.44 26.93,14.23 25.72,14.23 21.76,14.23 | v50.97,22.34 50.97,20.43 v49.85,19.31 | 32.49,18.78 30.61,18.78 27.95,21.44 v25.97,21.44 | v22.11,21.65 22.45,21.98 22.5,21.98 23.03,22.51 v23.69,22.51 | D2.C 37.18,14.68 D3.C 32.55,13.32 31.4,14.47 31.4,15.18 30.15,16.44 | v20.79,15.14 21.71,14.23 21.76,14.23 | U4.2 20.39,12.87
  Bottom 0.61: J3.P$33 25.65,9.22 v24.45,10.42 | v12.38,27.57 10.39,27.57 7.81,24.99 7.81,24.72 6.57,23.48 6.85,23.2 U2.3 | v16.37,28.35 16.37,29 v17.25,29.87 | v19.67,29.93 20.39,29.22 20.64,29.22 | R12.2 28.36,50.57 v28.36,51.31
  Bottom 0.813: v7.94,59.95 20.64,47.25 | 20.64,47.25 20.64,29.22 20.64,21.85 21.27,21.21 | v46.04,25.66 46.04,20.58 47.62,19 C9.1 | R12.2 28.74,49.49 28.74,48.68 27.31,47.25 20.64,47.25 | R2.2 21.91,48.52 20.64,47.25 | C20.1 C17.1 37.68,16.45 37.3,16.83 C16.1 C10.1 35.51,18.62 34.56,18.62 v34.56,18.52 | C20.1 C21.1 47.95,17.09 C9.1 | C20.1 C11.1 | R13.2 55.88,24.71 53.99,22.82 52.58,22.82 52.1,22.34 v50.97,22.34 | v49.85,19.31 49.53,19 C9.1 | v20.64,20.58 21.27,21.21 | 21.27,21.21 21.71,21.65 v22.11,21.65 | v23.69,22.51 24.91,22.51 v25.97,21.44 | v19.93,17.38 20.79,16.52 v20.79,15.14
CANH-1  (via drill 0.35)
  Top 0.254: v29.53,6.61 29.65,6.49 J3.P$5
  Bottom 0.254: U2.7 17.72,21.93 19.09,20.55 19.09,15.78 19.95,14.92 19.95,13.95 22.21,11.69 24.35,11.69 28.16,7.88 28.26,7.88 v29.53,6.61
CANH-2  (via drill 0.35)
  Top 0.254: U5.7 46.67,14.86 v44.77,12.96 | J3.P$7 31.65,7.54 v31.99,7.88
  Bottom 0.254: v44.77,12.96 41.35,9.54 35.73,9.54 34.06,7.88 v31.99,7.88
CANL-1  (via drill 0.35)
  Top 0.254: v29.53,15.5 30.65,14.38 J3.P$6 | v19.32,23.02 22.01,23.02 v22.11,22.92
  Bottom 0.254: v22.11,22.92 v29.53,15.5 | v19.32,23.02 19.17,23.17 16.42,23.17 U2.6
CANL-2  (via drill 0.35)
  Top 0.254: J3.P$8 32.65,8.93 v32.43,9.15 | U5.6 45.35,17.46 45.35,14.81 43.96,13.58 v43.96,13.48
  Bottom 0.254: v32.43,9.15 37.49,14.22 38.23,14.22 38.82,13.62 43.76,13.62 v43.96,13.48
DEBUG_RX
  Top 0.254: U3.2 40.1,42.48 40.1,43.74 38.67,45.17 JP1.2
DEBUG_TX
  Top 0.254: U3.3 38.82,42.63 JP1.1
GND  (via drill 0.35)
  Top 0.813: J3.P$3 27.65,5.9 28.56,6.82 | 28.92,12.1 28.56,11.74 28.56,6.82 | J3.P$4 28.65,6.17 28.59,6.22 28.59,6.79 28.56,6.82
  other vias: 19.22,28.81 56.35,53.6 61.74,27.03 13.02,61.37 13.07,56.75 16.63,33.84 16.42,43.08 44.36,26.88 44.52,39.38 28.92,13.42 7.38,19.01 8.5,19.01 62.19,40.44 64.63,43.74 66.46,38.87 70.58,19.46 56.91,19.06 52.95,17.63 51.07,13.37 46.09,12.45 38.72,11.99 32.68,11.99 21.76,10.62 20.13,10.93 15.31,30.79 14.04,30.54 14.59,33.18 14.8,37.75 15.86,34.8 16.68,32.67 14.7,42.83 19.32,42.37 14.75,55.63 12.21,57.82 12.31,60.1 22.52,42.02 30.34,43.14 25.87,34.55 37.96,17.99 38.72,20.48 42.59,24.44 44.87,20.88 49.9,21.14 50.87,34.65 33.14,41.81 39.59,40.75 27.5,23.07 9.77,18.85 10.99,18.85 14.04,18.9 14.95,18.75 7.53,17.58 8.75,17.58 9.97,17.63 11.24,17.43 12.66,17.38 13.83,17.43 73.42,20.78 73.68,19.01 71.95,20.83 74.49,20.68 70.68,20.78 71.64,19.36 74.28,19.72 75.66,20.63 77.18,20.78 74.89,18.95 76.52,18.85 77.08,17.74 75.45,17.58 73.73,17.53 71.74,17.99 74.69,14.59 70.22,18.09 71.59,16.47 70.22,16.41 71.64,15.09 70.37,15.04 70.27,13.62 71.64,13.67 70.93,12.4 73.73,15.6 73.57,13.72 73.83,12.4 76.57,15.91 75.15,15.7 76.01,14.74 75.4,13.62 77.08,13.93 75.55,12.4 77.08,12.45 7.43,16.21 9.11,15.96 10.28,16.01 11.85,15.91 12.92,15.91 14.24,15.8 8.19,14.94 9.11,13.93 7.33,13.93 11.14,14.48 13.12,14.79 15.2,17.38 14.85,14.38 13.43,13.67 10.94,13.26 12.05,13.26 14.75,12.45 14.95,10.88 13.53,11.89 7.48,12.1 8.8,12.15 10.33,11.99 12.05,11.94 12.61,10.62 10.58,10.37 9.11,10.32 7.89,10.32 38.42,26.52 36.39,27.74 32.37,44.1 38.47,40.49 41.47,51.97 45.79,56.19 50.61,55.33 55.39,49.94 50.76,51.31 47.46,52.63 39.59,54.11 56,42.98 52.9,46.08 56.35,57.82 54.88,38.61 55.18,35.26 53.36,34.65 61.13,24.24 60.72,10.88 65.65,25.2 74.79,10.47 18.1,19.61 16.17,25.81 22.77,28.76 28.77,22.1 26.94,11.44 36.49,11.59 37.56,49.74 50.71,58.12 57.57,61.52 60.01,55.02 69.87,55.99 74.54,57.16 75.4,45.17 70.98,47.5 67.93,46.54 71.69,42.53 63.36,36.53 19.01,14.43 28.01,19.77
  pour Top: 5.4,62.49 77.79,62.49 77.79,9.4 6.92,9.4 6.92,60.97
  pour Bottom: 5.4,62.49 77.79,62.49 77.79,9.15 6.67,9.15 6.67,61.22
GND83  (via drill 0.35)
  other vias: 19.22,34.19
GND103  (via drill 0.35)
  other vias: 19.32,32.62
LED-0  (via drill 0.35)
  Top 0.254: v16.83,37.09 v29.53,37.09 | v32.07,34.55 33.68,34.55 34.34,35.21 34.88,35.21 35.54,34.55 35.54,33.09 35.96,32.67 U3.12
  Bottom 0.254: 0.+ 15.79,36.05 v16.83,37.09 | v29.53,37.09 v32.07,34.55
LED-1  (via drill 0.35)
  Top 0.254: v16.83,40.9 23.18,40.9 v24.45,39.63 | v35.88,32.01 36.43,32.01 U3.13
  Bottom 0.254: 1.+ 16.6,41.13 v16.83,40.9 | v24.45,39.63 26.58,37.5 26.58,36.92 33.17,30.33 34.78,30.33 35.54,31.1 35.54,31.67 v35.88,32.01
LED-2  (via drill 0.35)
  Top 0.254: v16.83,44.71 21.91,44.71 v26.99,39.63 | v34.88,31.4 35.22,31.4 35.47,31.15 36.7,31.15 U3.14
  Bottom 0.254: 2.+ 15.33,46.21 v16.83,44.71 | v26.99,39.63 26.99,37.09 33.34,30.74 34.61,30.74 34.88,31.01 v34.88,31.4
LED-3  (via drill 0.35)
  Top 0.254: v19.37,45.98 21.91,45.98 v28.26,39.63 | v16.83,47.25 13.15,50.93 v13.15,52.33 | U3.15 37.43,30.74 34.61,30.74 34.03,31.32 34.03,32.01 34.61,32.59 v34.61,34.55
  Bottom 0.254: 3.+ 8.98,52.33 v13.15,52.33 | v16.83,47.25 18.1,47.25 v19.37,45.98 | v34.61,34.55 34.03,35.13 34.03,38.64 31.08,41.59 30.52,41.59 28.56,39.63 v28.26,39.63
LED-4
  Top 0.254: U3.11 35.59,36.8 33.05,36.8 32.07,35.82 22.95,26.7 4.+
LED-5
  Top 0.254: U3.10 36.13,37.39 32.38,37.39 26.76,31.78 5.+
LED-6
  Top 0.254: 6.+ 8.98,35.82 30.22,35.82 32.21,37.8 35.88,37.8 36.47,37.8 36.85,37.8 U3.9
LED-7
  Top 0.254: U3.8 37.12,38.66 12.71,38.66 9.44,41.94 7.+ | U3.8
LEDBUFF0
  Top 0.254: U8.4 56.83,38.99 54.93,40.9 53.47,40.9 52.91,40.35 50.43,40.35 U3.38
LEDBUFF1  (via drill 0.35)
  Top 0.254: U3.37 50.89,39.68 v52.44,39.68 | U9.4 55.77,28.84 v54.42,30.18
  Bottom 0.254: v52.44,39.68 53.1,39.02 53.1,38.06 54.07,37.1 54.07,30.54 v54.42,30.18
LEDBUFF2  (via drill 0.35)
  Top 0.254: U10.4 60.64,49.15 52.64,41.15 | 52.64,41.15 v52.64,41 | v51.5,38.54 50.89,38.54 U3.36 | v49.95,41.36 50.16,41.15 52.64,41.15
  Bottom 0.254: v51.5,38.54 51.29,38.54 49.95,39.88 v49.95,41.36
LEDBUFF3  (via drill 0.35)
  Top 0.254: U3.35 50.56,37.09 50.8,37.09 50.85,37.04 51.39,37.04 51.84,37.5 v52.64,37.5 | v51.12,42.17 v60.01,51.06 | U11.4 69.59,61.85 v70.17,61.27
  Bottom 0.254: v60.01,51.06 70.17,61.22 v70.17,61.27 | v51.12,42.17 51.07,42.12 51.07,39.99 52.54,38.51 52.54,37.6 v52.64,37.5
LEDBUFF_0A
  Top 0.152: U8.7 65.09,41.53
  Top 0.254: J2.1 68.27,41.53 65.09,41.53 69.16,45.61 R51.2
LEDBUFF_0B  (via drill 0.35)
  Top 0.254: U8.6 67.35,40.27 | 67.35,40.27 67.53,40.27 J2.2 | 67.35,40.27 v67.88,40.8 | v68.9,42.17 69.36,42.17 70.17,42.98 R51.1
  Bottom 0.254: v67.88,40.8 67.88,40.9 68.9,41.92 v68.9,42.17
LEDBUFF_1A
  Top 0.254: U9.7 63.82,31.38 | 63.82,31.38 64.45,31.38 67.45,34.37 J2.3 | R56.2 65.99,37.99 65.09,37.09 65.09,35.12 65.5,34.72 65.5,33.11 63.82,31.44 63.82,31.38
LEDBUFF_1B  (via drill 0.35)
  Top 0.254: U9.6 65.72,30.11 67,31.38 | 67,31.38 67.99,32.37 J2.4 | 67,31.38 67,32.64 v67.63,33.28 | v67.63,35.03 R56.1
  Bottom 0.254: v67.63,33.28 v67.63,35.03
LEDBUFF_2A  (via drill 0.35)
  Top 0.254: J2.5 71.06,30.74 v68.9,30.74 | U10.7 70.81,51.7 v71.44,51.06 71.81,50.69 R52.2
  Bottom 0.254: v68.9,30.74 68.9,41.24 69.56,41.9 69.56,50.45 70.17,51.06 v71.44,51.06
LEDBUFF_2B
  Top 0.254: U10.6 70.81,50.42 72.71,48.52 72.71,46.81 | 72.71,46.81 72.71,29.47 71.59,28.35 J2.6 | R52.1 73.98,48.08 72.71,46.81
LEDBUFF_3A  (via drill 0.35)
  Top 0.254: U11.7 60.01,59.31 58.74,58.04 | R53.2 54.93,58.31 54.93,57.41 56.2,56.14 56.83,56.14 58.74,58.04 | J2.7 67.7,30.11 v67.64,30.11 | v58.74,56.14 58.74,58.04
  Bottom 0.254: v67.64,30.11 58.74,39.01 v58.74,56.14
LEDBUFF_3B  (via drill 0.35)
  Top 0.254: U11.6 60.64,60.58 60.35,60.58 | 60.35,60.58 59,60.58 R53.1 | J2.8 67,28.81 v67,29.47 | v57.96,58.19 60.35,60.58
  Bottom 0.254: v67,29.47 57.96,38.51 v57.96,58.19
N$1  (via drill 0.35)
  Top 0.152: 30.8,28.09 30.86,28.14
  Top 0.254: R3.1 30.8,28.09 | 30.86,28.14 33.08,28.14 33.18,28.04 | 33.18,28.04 C15.1 | R4.1 26.99,28.2 v28.26,29.47 | v32.1,29.44 33.18,28.36 33.18,28.04
  Bottom 0.254: v28.26,29.47 32.07,29.47 v32.1,29.44
N$2
  Top 0.254: R1.2 16.8,52.04 S2.B2
N$3
  Top 0.254: R35.2 9.93,62.72 5V.-
N$4
  Top 0.254: R36.2 9.93,57.64 3V3.-
N$5  (via drill 0.35)
  Top 0.254: U3.42 46.65,41.1 46.65,41.17 47.31,41.83 v47.31,43.44 | v50.1,44.86 53.66,48.42 J1.5
  Bottom 0.254: v47.31,43.44 48.73,44.86 v50.1,44.86
N$6
  Top 0.254: R29.2 9.27,38.62 9.27,38.9 8.31,39.86 6.-
N$7  (via drill 0.35)
  Top 0.254: L1.1 v72.71,52.74 72.71,51.82 v72.76,51.77 | v67.63,9.15 66.36,9.15 63.39,12.12 63.39,16.24 65.64,18.49 U$3.2
  Bottom 0.254: v67.63,9.15 68.65,9.15 69.02,9.53 72.16,9.53 72.76,10.13 v72.76,51.77 | D5.C 67.56,53.04 72.41,53.04 v72.71,52.74
N$8
  Top 0.254: R6.1 VOUT1.A
N$35
  Top 0.254: 7.- 8.71,44.17 9.14,44.17 9.87,43.44 R30.2
N$36  (via drill 0.35)
  Top 0.254: U3.41 47.87,41.18 47.87,42.78 v47.97,42.78 | v50.16,43.39 50.09,43.39 49.45,44.03 49.45,45.58 52.39,48.52 52.39,59.82 J1.4
  Bottom 0.254: v50.16,43.39 49.75,43.39 49.14,42.78 v47.97,42.78
N$37  (via drill 0.35)
  Top 0.254: 37.29,39.63 v37.15,39.63 | U3.7 37.29,39.63 | 37.29,39.63
  Bottom 0.254: C4.1 37.15,38.29 v37.15,39.63
N$39
  Top 0.254: 5.- 8.14,34.78 8.76,34.16 9.04,34.16 9.92,33.28 R28.2
N$40
  Top 0.152: 8.17,29.47 4.-
  Top 0.254: R27.2 8.17,29.47
N$41
  Bottom 0.254: 3.- 8.71,49.06 9.06,49.06 9.79,49.79 R20.2
N$42
  Bottom 0.254: 2.- 8.66,43.93 9,43.93 9.79,44.71 R19.2
N$43
  Bottom 0.254: 1.- 8.71,38.9 9.06,38.9 9.79,39.63 R18.2
N$46
  Bottom 0.254: 0.- 8.71,33.82 9.06,33.82 9.79,34.55 R17.2
N$58
  Bottom 0.254: RX2.A 36.03,51.21 34.66,49.84 R12.1
N$59
  Bottom 0.254: R2.1 21.91,56.14 23.18,57.41 24.75,57.41 25.72,56.45 TX2.A
N$60
  Top 0.254: R31.1 16.93,62.27 RX3.A
N$61
  Top 0.254: R32.1 16.93,55.09 TX3.A
NSIL_1  (via drill 0.35)
  Top 0.254: U3.32 51.73,30.84 51.73,30.47 52.73,29.47 v53.66,29.47 | v42.99,22.31 49.04,22.31 v49.85,23.12 | v19.7,24.03 24.5,24.03 v24.57,23.96
  Bottom 0.254: 52.39,25.66 DNP1.1 53.66,28.52 v53.66,29.47 | 52.39,25.66 R13.1 | v24.57,23.96 24.62,23.96 27.47,21.11 32.6,21.11 33.9,22.41 42.89,22.41 v42.99,22.31 | U2.5 16.45,24.41 19.37,24.41 19.7,24.08 v19.7,24.03 | v49.85,23.12 52.39,25.66
NSIL_2  (via drill 0.35)
  Top 0.254: U5.5 44.13,16.14 43.5,15.5 42.23,15.5 40.96,16.77 40.96,24.39 v42.23,25.66 41.87,26.02 41.32,26.02 v40.96,25.66 | v47.31,26.93 47.31,28.7 47.46,28.85 47.46,29.46 U3.27 | R15.1 35.44,23.63 v38.73,23.63 37.15,22.05 DNP2.1
  Bottom 0.254: v47.31,26.93 45.7,26.93 44.84,26.07 42.64,26.07 v42.23,25.66 | v40.96,25.66 40.76,25.66 v38.73,23.63
OSC1
  Top 0.254: C19.2 55.5,20.58 R21.1 54.11,21.86 52.74,21.86 50.37,24.22 U$1.3 50.37,26.81 51.3,27.74 51.3,29.07 51.14,29.24 51.08,29.24 U3.30
OSC2
  Top 0.254: R21.2 54.17,24.83 55.76,26.42 C18.2 54.66,26.42 U$1.1 52.67,28.77 U3.31
RST  (via drill 0.35)
  Top 0.254: v18.1,45.98 R1.1 19.77,48.84 v20.23,49.31 | v22.01,25 21.91,25.1 19.67,25.1 v19.52,25.25 | v30.8,21.85 30.8,24.39 | 30.8,24.39 R3.2 | v33.34,23.12 32.07,23.12 30.8,24.39 | J1.1 43.5,58.68 v42.23,57.41 | v37.78,56.77 37.51,56.5 v34.76,56.5 | v24.7,56.29 v26.73,56.29 | J3.P$26 52.65,7.62 50.48,9.79 v50.48,9.76 | U3.18 39.96,29.74 37.15,26.93 v37.15,24.39
  Bottom 0.254: v18.1,45.98 18.1,26.68 v19.52,25.25 | v22.01,25 27.65,25 v30.8,21.85 | v33.34,23.12 35.88,23.12 v37.15,24.39 37.15,23.46 37.79,22.82 42.23,22.82 45.76,26.35 46.32,26.35 46.73,25.94 46.73,25.31 51.84,20.2 51.84,11.12 v50.48,9.76 | v42.23,57.41 41.59,56.77 v37.78,56.77 | v20.23,49.31 20.88,49.95 20.88,53.42 21.08,53.62 22.78,53.62 22.94,53.78 22.94,53.97 24.7,55.73 v24.7,56.29 | v34.76,56.5 33.34,56.5 33.14,56.29 v26.73,56.29
RX_1  (via drill 0.35)
  Top 0.254: U3.44 45.63,42.34 45.63,45.98 | J7.1 45.63,50.32 45.63,45.98 | v16.83,30.74 v23.18,30.74 | v42.23,48.52 43.09,48.52 45.63,45.98
  Bottom 0.254: J7.1 36.03,59.92 RX2.C | v23.18,30.74 23.79,31.35 23.79,39.9 32.41,48.52 v42.23,48.52 | v16.83,30.74 11.7,25.61 9.26,25.61 8.4,24.75 8.68,24.47 U2.4
RX_2  (via drill 0.35)
  Top 0.254: J8.1 27.69,59.38 | RX3.C 22.13,58.68 26.99,58.68 27.69,59.38 | 43.58,28.97 43.58,25.28 44.13,24.72 U5.4 | U3.34 43.58,28.97 | 43.58,28.97 43.52,28.91 43.52,43.72 v40.6,46.64 | 27.69,59.38 v31.43,55.63
  Bottom 0.254: v31.43,55.63 33.64,53.43 38.25,53.43 42.89,48.79 42.89,48.25 42.5,47.86 41.83,47.86 v40.6,46.64
STBY-1
  Bottom 0.254: U2.8 16.4,16.49 18,14.89 R14.2
STBY-2
  Top 0.254: U5.8 R16.2
TX_1  (via drill 0.35)
  Top 0.254: U3.43 46.04,41.61 46.04,48.52 | J7.2 46.04,52.2 46.04,48.52 | v24.68,27.16 28.29,30.77 v30.77,30.77 | v39.69,45.98 38.42,47.25 v29.53,47.25 26.99,47.25 v25.72,48.52 | 46.04,48.52 v47.31,47.25 | v14.34,29.22 17.64,29.22 19.5,27.36 v21.58,27.36
  Bottom 0.254: v29.53,47.25 29.53,46.21 22.52,39.21 22.52,30.47 22.91,30.08 23.45,30.08 24.14,30.77 v30.77,30.77 | v39.69,45.98 46.04,45.98 v47.31,47.25 | TX2.C v25.72,48.52 | U2.1 6.75,20.66 5.45,21.95 5.45,23.93 10.73,29.22 v14.34,29.22 | v21.58,27.36 21.75,27.18 24.65,27.18 v24.68,27.16
TX_2  (via drill 0.35)
  Top 0.254: J8.2 31.94,57.41 | 31.94,57.41 44.97,44.38 v44.97,43.19 | U3.33 51.7,32.01 v52.39,32.01 52.8,31.6 52.8,31.15 v52.39,30.74 | TX3.C v20.64,58.68 | v30.8,57.41 31.94,57.41 | v48.94,28.05 48.94,27.54 47.95,26.55 U5.1
  Bottom 0.254: v52.39,32.01 52.64,32.26 52.64,36.43 45.89,43.19 v44.97,43.19 | v20.64,58.68 29.53,58.68 v30.8,57.41 | v52.39,30.74 52.39,30.23 51.37,29.22 50.1,29.22 v48.94,28.05
WATCH_2
  Top 0.254: J3.P$19 45.65,10.81 39.69,16.77 39.69,26.21 U3.21

### Text on the board
tNames: RX_2 | TX_2 | RX_1 | TX_1 | CAN2 | CAN1 | DEBUG_RX | DEBUG_TX | LED Card / Spring 2020 / Grant Crump